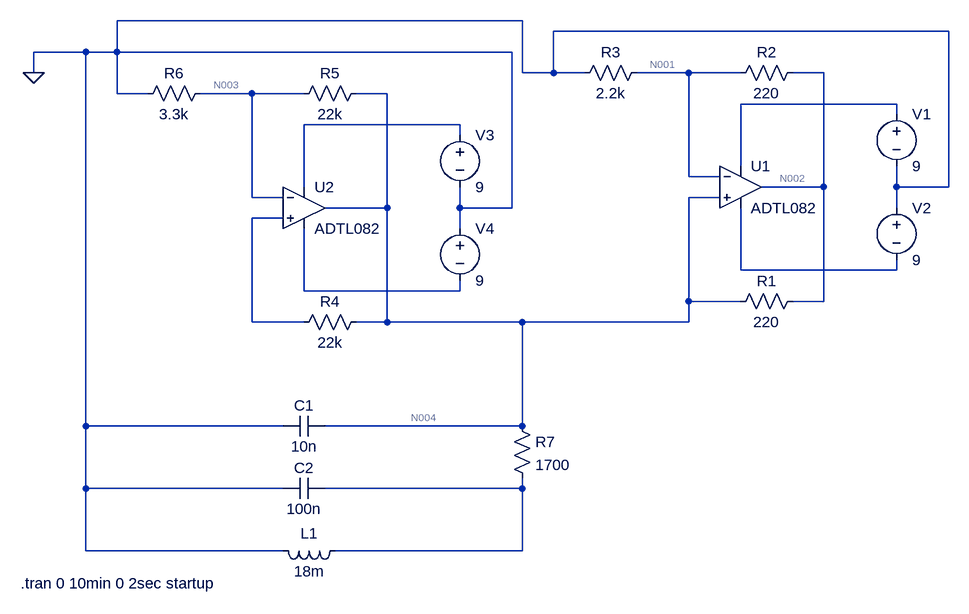
[diagram p0: schematic NR1.asc]
NR1.asc, the LTspice schematic file:
Version 4
SHEET 1 880 868
WIRE -128 -16 -752 -16
WIRE 528 0 -80 0
WIRE -800 32 -880 32
WIRE -752 32 -752 -16
WIRE -752 32 -800 32
WIRE -144 32 -752 32
WIRE -880 64 -880 32
WIRE -128 64 -128 -16
WIRE -80 64 -80 0
WIRE -80 64 -128 64
WIRE -32 64 -80 64
WIRE 128 64 48 64
WIRE 208 64 128 64
WIRE 336 64 288 64
WIRE -752 96 -752 32
WIRE -704 96 -752 96
WIRE -544 96 -624 96
WIRE -464 96 -544 96
WIRE -336 96 -384 96
WIRE 448 112 208 112
WIRE 448 128 448 112
WIRE -224 144 -464 144
WIRE -224 160 -224 144
WIRE 208 208 208 112
WIRE 128 224 128 64
WIRE 176 224 128 224
WIRE -464 240 -464 144
WIRE 336 240 336 64
WIRE 336 240 240 240
WIRE 448 240 448 208
WIRE 528 240 528 0
WIRE 528 240 448 240
WIRE -544 256 -544 96
WIRE -496 256 -544 256
WIRE 176 256 128 256
WIRE -336 272 -336 96
WIRE -336 272 -432 272
WIRE -224 272 -224 240
WIRE -144 272 -144 32
WIRE -144 272 -224 272
WIRE 448 272 448 240
WIRE -496 288 -544 288
WIRE -224 304 -224 272
WIRE 208 368 208 272
WIRE 448 368 448 352
WIRE 448 368 208 368
WIRE -464 400 -464 304
WIRE -224 400 -224 384
WIRE -224 400 -464 400
WIRE 128 416 128 256
WIRE 208 416 128 416
WIRE 336 416 336 240
WIRE 336 416 288 416
WIRE -544 448 -544 288
WIRE -464 448 -544 448
WIRE -336 448 -336 272
WIRE -336 448 -384 448
WIRE -128 448 -336 448
WIRE 128 448 128 416
WIRE 128 448 -128 448
WIRE -800 608 -800 32
WIRE -496 608 -800 608
WIRE -128 608 -128 448
WIRE -128 608 -432 608
WIRE -800 704 -800 608
WIRE -496 704 -800 704
WIRE -128 704 -128 688
WIRE -128 704 -432 704
WIRE -800 800 -800 704
WIRE -496 800 -800 800
WIRE -128 800 -128 704
WIRE -128 800 -416 800
FLAG -880 64 0
SYMBOL voltage 448 112 R0
WINDOW 123 0 0 Left 0
WINDOW 39 0 0 Left 0
SYMATTR InstName V1
SYMATTR Value 9
SYMBOL voltage 448 256 R0
WINDOW 123 0 0 Left 0
WINDOW 39 0 0 Left 0
SYMATTR InstName V2
SYMATTR Value 9
SYMBOL res 304 400 R90
WINDOW 0 0 56 VBottom 2
WINDOW 3 32 56 VTop 2
SYMATTR InstName R1
SYMATTR Value 220
SYMBOL res 304 48 R90
WINDOW 0 0 56 VBottom 2
WINDOW 3 32 56 VTop 2
SYMATTR InstName R2
SYMATTR Value 220
SYMBOL res 64 48 R90
WINDOW 0 0 56 VBottom 2
WINDOW 3 32 56 VTop 2
SYMATTR InstName R3
SYMATTR Value 2.2k
SYMBOL voltage -224 144 R0
WINDOW 123 0 0 Left 0
WINDOW 39 0 0 Left 0
SYMATTR InstName V3
SYMATTR Value 9
SYMBOL voltage -224 288 R0
WINDOW 123 0 0 Left 0
WINDOW 39 0 0 Left 0
SYMATTR InstName V4
SYMATTR Value 9
SYMBOL res -368 432 R90
WINDOW 0 0 56 VBottom 2
WINDOW 3 32 56 VTop 2
SYMATTR InstName R4
SYMATTR Value 22k
SYMBOL res -368 80 R90
WINDOW 0 0 56 VBottom 2
WINDOW 3 32 56 VTop 2
SYMATTR InstName R5
SYMATTR Value 22k
SYMBOL res -608 80 R90
WINDOW 0 0 56 VBottom 2
WINDOW 3 32 56 VTop 2
SYMATTR InstName R6
SYMATTR Value 3.3k
SYMBOL cap -432 592 R90
WINDOW 0 0 32 VBottom 2
WINDOW 3 32 32 VTop 2
SYMATTR InstName C1
SYMATTR Value 10n
SYMBOL cap -432 688 R90
WINDOW 0 0 32 VBottom 2
WINDOW 3 32 32 VTop 2
SYMATTR InstName C2
SYMATTR Value 100n
SYMBOL ind -400 784 R90
WINDOW 0 5 56 VBottom 2
WINDOW 3 32 56 VTop 2
SYMATTR InstName L1
SYMATTR Value 18m
SYMBOL res -144 592 R0
SYMATTR InstName R7
SYMATTR Value 1700
SYMBOL OpAmps\\ADTL082 208 176 R0
SYMATTR InstName U1
SYMBOL OpAmps\\ADTL082 -464 208 R0
SYMATTR InstName U2
TEXT -900 850 Left 2 !.tran 0 10min 0 2sec startup

The netlist it stands for:
* NR1.asc
V1 N005 0 9
V2 0 N008 9
R1 N002 N004 220
R2 N002 N001 220
R3 N001 0 2.2k
V3 N006 0 9
V4 0 N009 9
R4 N004 N007 22k
R5 N004 N003 22k
R6 N003 0 3.3k
C1 N004 0 10n
C2 N010 0 100n
L1 N010 0 18m
R7 N004 N010 1700
XU1 N004 N001 N005 N008 N002 ADTL082  ; pins In+ In- V+ V- OUT
XU2 N007 N003 N006 N009 N004 ADTL082  ; pins In+ In- V+ V- OUT
.tran 0 10min 0 2sec startup
.lib ADI.lib
.backanno
.end

* Results of the author's LTspice run, read from the files saved beside the schematic
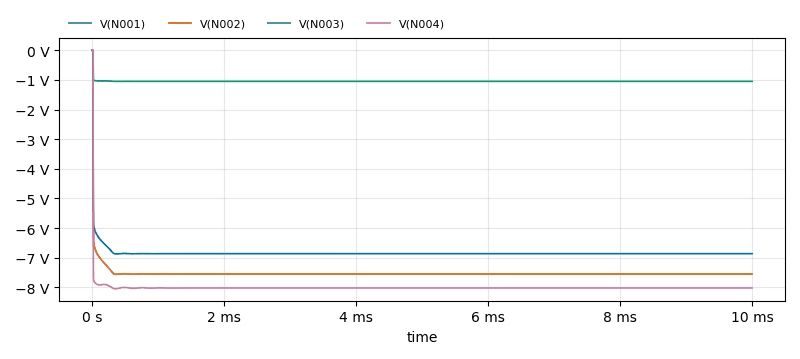
[diagram p1: Transient Analysis of NR1.asc, plotted from the saved traces]
* Transient Analysis, 1 run:
*   V(N001): min -6.878 V, max 0 V, average -6.844 V, rms 6.85 V, last -6.867 V
*   V(N002): min -7.565 V, max 0 V, average -7.528 V, rms 7.535 V, last -7.554 V
*   V(N003): min -1.05 V, max 0 V, average -1.045 V, rms 1.046 V, last -1.047 V
*   V(N004): min -8.054 V, max 0 V, average -8.009 V, rms 8.016 V, last -8.026 V